# Altium schematic sheet 100nF Cap.schdoc
size 124 x 101 mm
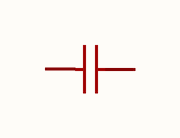
[diagram p0: 100nF Cap.schdoc]

## Parts
C?  100nF  [C0603]  (value not drawn)

## Nets

Not connected (* = marked no-connect by the designer): C? 1 2

## Library data of the parts
C? = GRM188R71C104KA01D: Manufacturer: muRata(村田); Add into BOM: yes; Tolerance: ±10%; Symbol: GRM188R71C104KA01D; Device: GRM188R71C104KA01D; LCSC Part Name: 100nF ±10% 16V; Supplier Part: C45000; Manufacturer Part: GRM188R71C104KA01D; Supplier Footprint: 0603; JLCPCB Part Class: Extended Part; Datasheet: https://atta.szlcsc.com/upload/public/pdf/source/20161108/1478586365848.pdf; Supplier: LCSC; Convert to PCB: yes; Value: 100nF